# Altium schematic sheet MCU.SchDoc: MCU
size A3; Author: Silard Gal; SheetNumber: 5; SheetTotal: 7
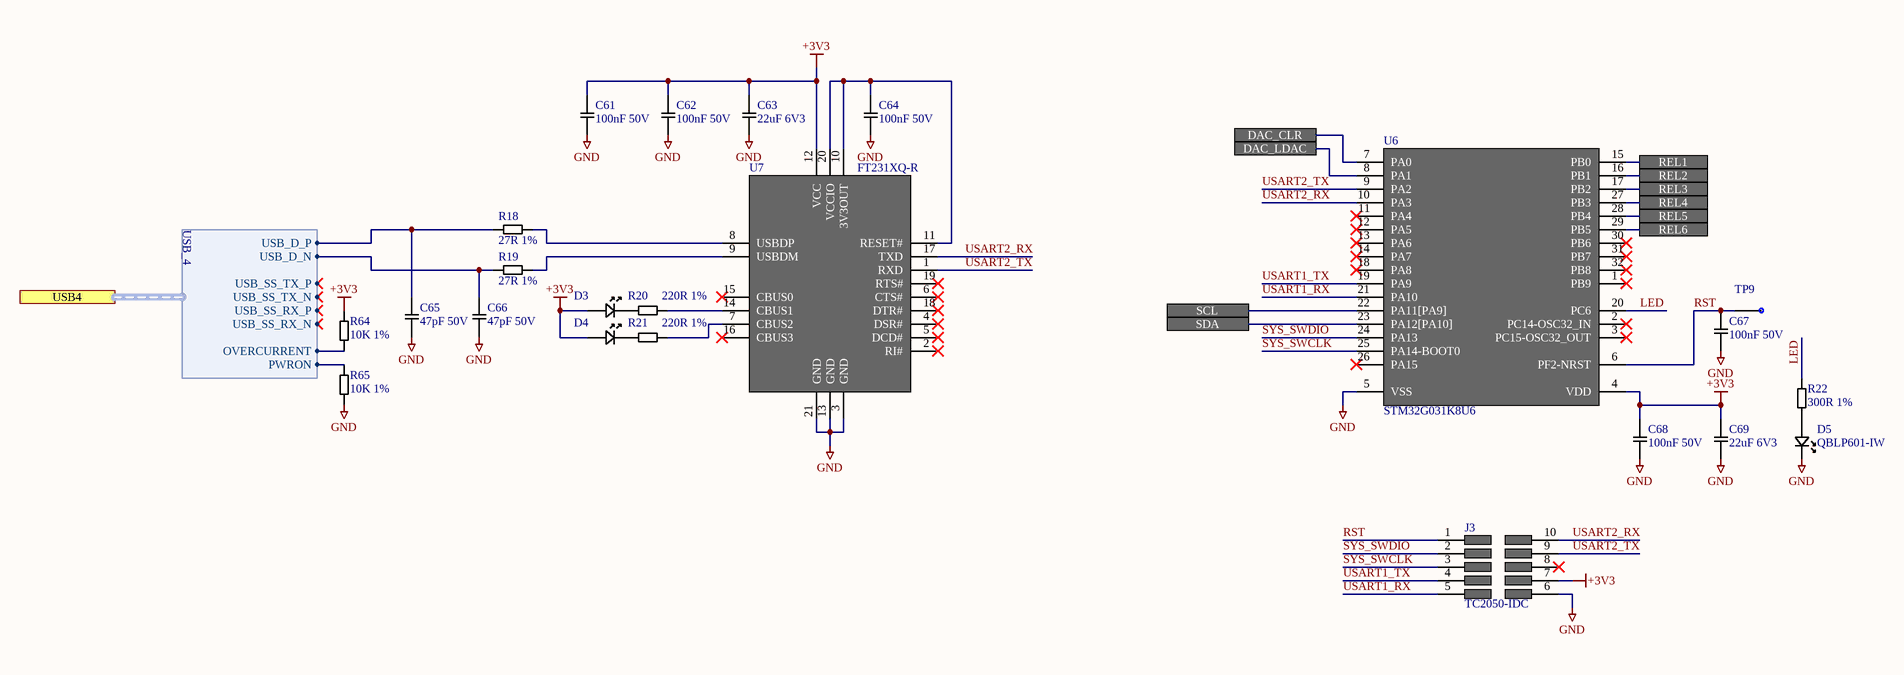
[diagram p0: MCU.SchDoc]

## Parts
C61  100nF 50V  [CAPC1608X06N]
C62  100nF 50V  [CAPC1608X06N]
C63  22uF 6V3  [CAPC1608X06N]
C64  100nF 50V  [CAPC1608X06N]
C65  47pF 50V  [CAPC1608X06N]
C66  47pF 50V  [CAPC1608X06N]
C67  100nF 50V  [CAPC1608X06N]
C68  100nF 50V  [CAPC1608X06N]
C69  22uF 6V3  [CAPC1608X06N]
D3  QBLP601-IW  [LEDC1608X06N]  (value not drawn)
D4  QBLP601-IW  [LEDC1608X06N]  (value not drawn)
D5  QBLP601-IW  [LEDC1608X06N]
J3  TC2050-IDC  [TAG_CONNECT]
R18  27R 1%  [RESC1608X06N]
R19  27R 1%  [RESC1608X06N]
R20  220R 1%  [RESC1608X06N]
R21  220R 1%  [RESC1608X06N]
R22  300R 1%  [RESC1608X06N]
R64  10K 1%  [RESC1608X06N]
R65  10K 1%  [RESC1608X06N]
TP9  TP  [TP]  (value not drawn)  (no BOM)
U6  STM32G031K8U6  [UQFP32P50X50]
U7  FT231XQ-R  [QFN50P400X400X80-21N]

## Ports
DAC_CLR, DAC_LDAC, REL1, REL2, REL3, REL4, REL5, REL6, SCL, SDA, USB4 (harness USB_4)

## Harnesses
USB_4: USB_D_P, USB_D_N, USB_SS_TX_P, USB_SS_TX_N, USB_SS_RX_P, USB_SS_RX_N, OVERCURRENT, PWRON

## Nets
+3V3: C61.1 C62.1 C63.1 C68.1 C69.1 D3.1 D4.1 J3.7 R64.2 U6.4(VDD) U7.12(VCC)
GND: C61.2 C62.2 C63.2 C64.2 C65.1 C66.1 C67.2 C68.2 C69.2 D5.2 J3.6 R65.1 U6.5(VSS) U7.3(GND) U7.13(GND) U7.21(GND)
DAC_CLR: U6.7(PA0) ; port DAC_CLR
DAC_LDAC: U6.8(PA1) ; port DAC_LDAC
LED: R22.2 U6.20(PC6)
REL1: U6.15(PB0) ; port REL1
REL2: U6.16(PB1) ; port REL2
REL3: U6.17(PB2) ; port REL3
REL4: U6.27(PB3) ; port REL4
REL5: U6.28(PB4) ; port REL5
REL6: U6.29(PB5) ; port REL6
RST: C67.1 J3.1 TP9.1 U6.6(PF2-NRST)
SCL: U6.22(PA11[PA9]) ; port SCL
SDA: U6.23(PA12[PA10]) ; port SDA
SYS_SWCLK: J3.3 U6.25(PA14-BOOT0)
SYS_SWDIO: J3.2 U6.24(PA13)
USART1_RX: J3.5 U6.21(PA10)
USART1_TX: J3.4 U6.19(PA9)
USART2_RX: J3.10 U6.10(PA3) U7.17(TXD)
USART2_TX: J3.9 U6.9(PA2) U7.1(RXD)
NetC64_1: C64.1 U7.10(3V3OUT) U7.11(RESET#) U7.20(VCCIO)
NetC65_2: C65.2 R18.1 ; port USB4.USB_D_P
NetC66_2: C66.2 R19.1 ; port USB4.USB_D_N
NetD3_2: D3.2 R20.1
NetD4_2: D4.2 R21.1
NetD5_1: D5.1 R22.1
NetR18_2: R18.2 U7.8(USBDP)
NetR19_2: R19.2 U7.9(USBDM)
NetR20_2: R20.2 U7.14(CBUS1)
NetR21_2: R21.2 U7.7(CBUS2)
NetR64_1: R64.1 ; port USB4.OVERCURRENT
NetR65_2: R65.2 ; port USB4.PWRON

Not connected (* = marked no-connect by the designer): J3 8*; U6 1(PB9)* 2(PC14-OSC32_IN)* 3(PC15-OSC32_OUT)* 11(PA4)* 12(PA5)* 13(PA6)* 14(PA7)* 18(PA8)* 26(PA15)* 30(PB6)* 31(PB7)* 32(PB8)*; U7 2(RI#)* 4(DSR#)* 5(DCD#)* 6(CTS#)* 15(CBUS0)* 16(CBUS3)* 18(DTR#)* 19(RTS#)*

## Notes on the sheet
- Title:
- Author:
- Size:
- Date:
- A3
- Prj:
- https://www.silardgal.com
- SW Version:
- Variant:
- Edited:
- File:

## Library data of the parts
C61 C62 C64 C67 C68 = 100nF 50V: 0.1 µF ±10% 50V Ceramic Capacitor X7R 0603 (1608 Metric); MPN: GCM188R71H104KA57D
C63 C69 = 22uF 6V3: 22 µF ±20% 6.3V Ceramic Capacitor X5R 0603 (1608 Metric); MPN: GRM188R60J226MEA0D
C65 C66 = 47pF 50V: 47 pF ±5% 50V Ceramic Capacitor C0G, NP0 0603 (1608 Metric); MPN: CL10C470JB8NNNC
D3-D5 = LED WHITE: White LED Indication - Discrete 3.2V 0603 (1608 Metric); MPN: QBLP601-IW
R18 R19 = 27R 1%: 27 Ohms ±1% 0.1W, 1/10W Chip Resistor 0603 (1608 Metric) Moisture Resistant Thick Film; MPN: RC0603FR-0727RL
R20 R21 = 220R 1%: 220 Ohms ±1% 0.1W, 1/10W Chip Resistor 0603 (1608 Metric) Automotive AEC-Q200 Thick Film; MPN: ERJ-3EKF2200V
R22 = 300R 1%: 300 Ohms ±1% 0.1W, 1/10W Chip Resistor 0603 (1608 Metric) Automotive AEC-Q200 Thick Film; MPN: ERJ-3EKF3000V
R64 R65 = 10K 1%: 10 kOhms ±1% 0.1W, 1/10W Chip Resistor 0603 (1608 Metric) Automotive AEC-Q200 Thick Film; MPN: ERJ-3EKF1002V
U6 = STM32G031K8U6: ARM® Cortex®-M0+ STM32G0 Microcontroller IC 32-Bit Single-Core 64MHz 64KB (64K x 8) FLASH 32-UFQFPN (5x5); MPN: STM32G031K8U6
U7 = FT231XQ-R: USB Bridge, USB to UART USB 2.0 UART Interface 20-QFN (4x4); MPN: FT231XQ-R
J3 = TC2050-IDC: MPN: TC2050-IDC